# Altium schematic sheet ANA_SWITCH.SchDoc
size 420 x 297 mm; SheetNumber: 35; SheetTotal: 35
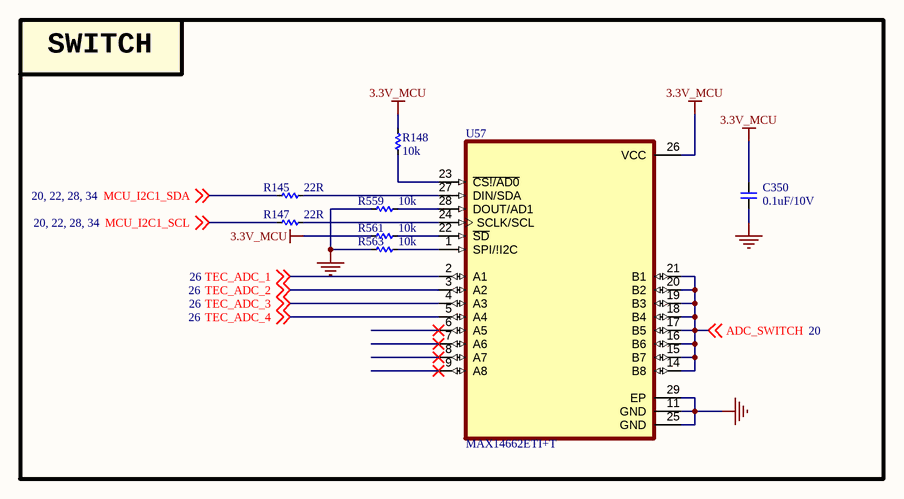
[diagram p0: ANA_SWITCH.SchDoc]

## Parts
C350  0.1uF/10V  [CAP_C_1005X60]
R145  22R  [RES_C_1005X40]
R147  22R  [RES_C_1005X40]
R148  10k  [RES_C_1005X40]
R559  10k  [RES_C_1005X40]
R561  10k  [RES_C_1005X40]
R563  10k  [RES_C_1005X40]
U57  MAX14662ETI+T  [QFN40P400X400X80-29N]

## Blocks framed on the sheet
SWITCH: C350 R145 R147 R148 R559 R561 R563 U57

## Nets
3.3V_MCU: C350.2 R148.1 R561.1 U57.26(VCC)
GND: C350.1 R559.1 R563.1 U57.11(GND) U57.25(GND) U57.29(EP)
ADC_SWITCH: U57.14(B8) U57.15(B7) U57.16(B6) U57.17(B5) U57.18(B4) U57.19(B3) U57.20(B2) U57.21(B1) ; off-sheet ADC_SWITCH
MCU_I2C1_SCL: R147.1 ; off-sheet MCU_I2C1_SCL
MCU_I2C1_SDA: R145.1 ; off-sheet MCU_I2C1_SDA
TEC_ADC_1: U57.2(A1) ; off-sheet TEC_ADC_1
TEC_ADC_2: U57.3(A2) ; off-sheet TEC_ADC_2
TEC_ADC_3: U57.4(A3) ; off-sheet TEC_ADC_3
TEC_ADC_4: U57.5(A4) ; off-sheet TEC_ADC_4
NetR145_2: R145.2 U57.27(DIN/SDA)
NetR147_2: R147.2 U57.24(SCLK/SCL)
NetR148_2: R148.2 U57.23(~{CS!/AD0})
NetR559_2: R559.2 U57.28(DOUT/AD1)
NetR561_2: R561.2 U57.22(~{SD})
NetR563_2: R563.2 U57.1(SPI/!I2C)

Not connected (* = marked no-connect by the designer): U57 6(A5)* 7(A6)* 8(A7)* 9(A8)*

## Notes on the sheet
- Project:
- Sub-system:
- Design by:
- Sheet title:
- Sheet
- of
- Checked by:
- Approved by:
- Revision:
- Document No:
- Size:
- Date:
- A3

## Library data of the parts
C350 = _CAP_C_2: CAP
R145 R147 R148 R559 R561 R563 = _RES_B_2: RES
U57 = IC_SW_MAX14662ETI+T: 8 Circuit IC Switch 1:1 1Ohm 28-TQFN _4x4_; MF: Maxim Integrated; Package: TQFN-28 Maxim; Value: *; Price: None; MP: MAX14662ETI+T; SnapEDA_Link: https://www.snapeda.com/parts/MAX14662ETI%2BT/Maxim%20Integrated/view-part/546683/?ref=snap; Availability: Unavailable